# Altium schematic sheet I2CInterface.SchDoc
size A4; CompanyName: Technische Hochschule Nürnberg Georg Simon Ohm; Organization: UltraZohm; Address1: Kesslerplatz 12; Address2: 90489 Nürnberg; Address3: GERMANY; DocumentNumber: 12; SheetNumber: 12; SheetTotal: 12; Website: www.ultrazohm.com
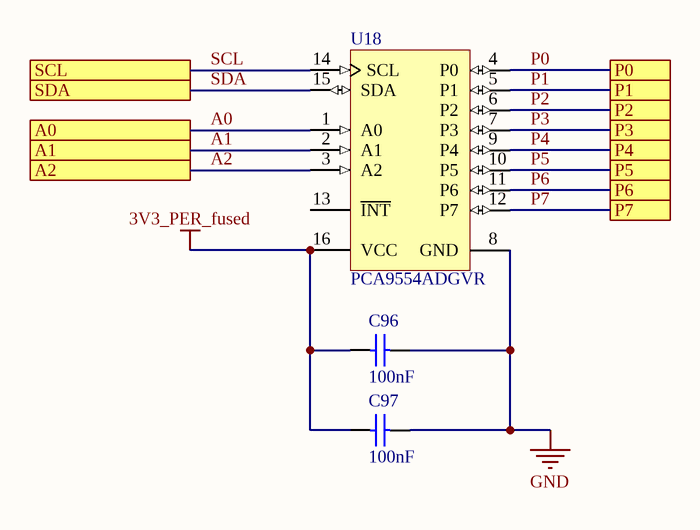
[diagram p0: I2CInterface.SchDoc]

## Parts
C96  100nF  [CAPC1608X07N]
C97  100nF  [CAPC1608X07N]
U18  PCA9554ADGVR  [DGV0016A_L]

## Ports
A0, A1, A2, P0, P1, P2, P3, P4, P5, P6, P7, SCL, SDA

## Nets
3V3_PER_fused: C96.1 C97.1 U18.16(VCC)
GND: C96.2 C97.2 U18.8(GND)
A0: U18.1(A0) ; port A0
A1: U18.2(A1) ; port A1
A2: U18.3(A2) ; port A2
P0: U18.4(P0) ; port P0
P1: U18.5(P1) ; port P1
P2: U18.6(P2) ; port P2
P3: U18.7(P3) ; port P3
P4: U18.9(P4) ; port P4
P5: U18.10(P5) ; port P5
P6: U18.11(P6) ; port P6
P7: U18.12(P7) ; port P7
SCL: U18.14(SCL) ; port SCL
SDA: U18.15(SDA) ; port SDA

Not connected (* = marked no-connect by the designer): U18 13(~{INT})

## Notes on the sheet
- Title
- Revision:
- Design Engineer:
- Date:
- Project:
- Sheet
- of

## Library data of the parts
C96 C97 = Cap_0603: MPN: 885012206071; MF: Würth; Voltage: 25V; Value: 100nF; Supplier 1: Mouser; Supplier 2: *; Supplier Part Number 1: 710-885012206071; Supplier Part Number 2: *
U18 = CMP-0314-00393-2: Remote 8-Bit I2C and SMBus I/O Expander with Interrupt Output and Configuration Registers, 8 Outputs, 2.3 to 5.5 V, -40 to 85 degC, 16-pin TVSOP (DGV), Green (RoHS & no Sb/Br); Manufacturer: Texas Instruments; No. of Outputs: 8; Push-Pull I/O Type: Yes; VCC(Max)(V): 5.5; Max Frequency(kHz): 400; fSCLK(Max)(MHz): 0.1, 0.4; VCC(Min)(V): 2.3; I2C Address: 0111 xxx; SubFamily: I2C IO Expander; PackageVersion: revE, Aug-2000; Code_JEDEC: MO-194; ComponentLink1Description: Datasheet; PackageDescription: 16-Pin Thin Shrink Small Outline Package 0.4 mm Pitch; ComponentLink1URL: http://www.ti.com/general/docs/lit/getliterature.tsp?genericPartNumber=PCA9554A&fileType=pdf; Configuration Registers: Yes; PartNumber: PCA9554ADGVR; ComponentLink2Description: Package Specification; PackageReference: DGV0016A; Mounting Technology: Surface Mount; Vcc range(V): 2.3 to 5.5; DatasheetVersion: SCPS127D; # of I/Os: 8; 5V Tolerant I/O: Yes; ComponentLink2URL: http://www.ti.com/litv/pdf/msso002e; Interrupt Output: Yes; Eco-Plan: Green (RoHS & no Sb/Br)